# Altium project ESC.PrjPcb
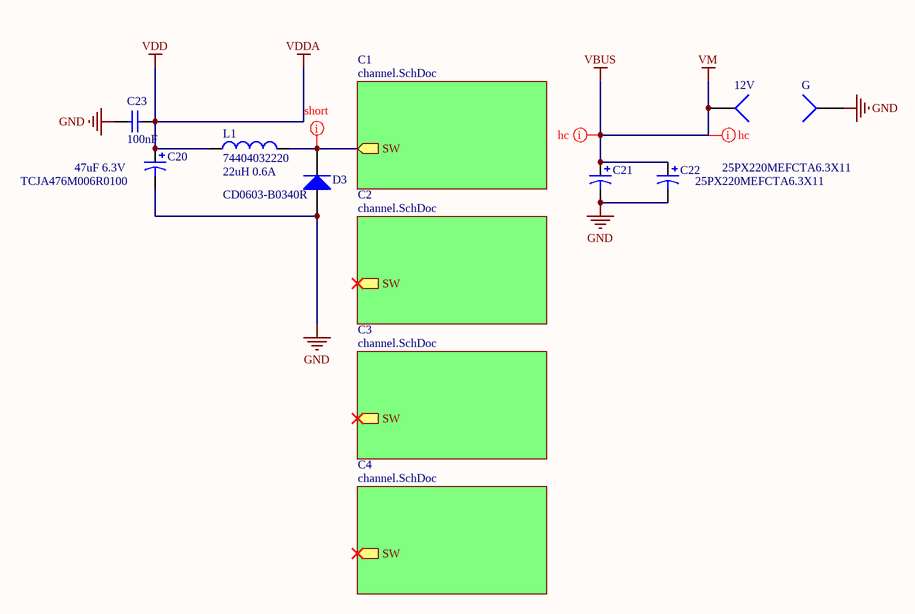
[diagram p0: esc.SchDoc]
3 sheets, 336 parts. Net scope: hierarchical (ports join the sheet entries above them; power ports are global).
Board file: esc.PcbDoc
Sheets:
  esc.SchDoc
    C1 = channel.SchDoc
      U = driver.SchDoc
      V = driver.SchDoc
      W = driver.SchDoc
    C2 = channel.SchDoc
      U = driver.SchDoc
      V = driver.SchDoc
      W = driver.SchDoc
    C3 = channel.SchDoc
      U = driver.SchDoc
      V = driver.SchDoc
      W = driver.SchDoc
    C4 = channel.SchDoc
      U = driver.SchDoc
      V = driver.SchDoc
      W = driver.SchDoc

## Sheet esc.SchDoc
size A4

### Parts
12V  12V  [large_pin]  (value not drawn)
C20  TCJA476M006R0100  value 47uF 6.3V  [my_1206_pol]
C21  25PX220MEFCTA6.3X11  [rad_2.5mm_0.7mm]
C22  25PX220MEFCTA6.3X11  [rad_2.5mm_0.7mm]
C23  100nF  [MY_0402]
D3  CD0603-B0340R  [my_0603]
G  G  [large_pin]  (value not drawn)
L1  74404032220  value 22uH 0.6A  [IND_3_3]

### Sub-sheets
C1 = channel.SchDoc: SW (out)
C2 = channel.SchDoc: SW (out)
C3 = channel.SchDoc: SW (out)
C4 = channel.SchDoc: SW (out)

### Nets
GND: C20.2 C21.2 C22.2 C23.1 D3.1(A) G.1
VBUS: 12V.1 C21.1 C22.1  [also labelled VM]
VDD: C20.1 C23.2 L1.1  [also labelled VDDA]
NetD3_2: D3.2(K) L1.2 ; sheet C1/SW

### Layout directives
net class hc: VBUS
net class short: NetD3_2

### Library data of the parts
12V G = Socket: LatestRevisionDate: 17-Jul-2002; LatestRevisionNote: Re-released for DXP Platform.; Publisher: Altium Limited
C20 = Cap Pol3: Polarized Capacitor (Surface Mount); Published: 8-Jun-2000; LatestRevisionDate: 29-May-2009; LatestRevisionNote: IPC-7351 Footprint Added.; PackageReference: C0805; Publisher: Altium Limited; PackageDescription: Chip Capacitor
C21 C22 = Cap Pol3: Polarized Capacitor (Surface Mount); Value: 10uF; Published: 8-Jun-2000; LatestRevisionDate: 29-May-2009; LatestRevisionNote: IPC-7351 Footprint Added.; PackageReference: C0805; Publisher: Altium Limited; PackageDescription: Chip Capacitor
C23 = Cap: Capacitor; Published: 8-Jun-2000; LatestRevisionDate: 17-Jul-2002; LatestRevisionNote: Re-released for DXP Platform.; PackageReference: RAD-0.3; Publisher: Altium Limited; PackageDescription: Radial Cap, Thru-Hole; 2 Leads; 0.3 in Pin Spacing; Value: 100nF
D3 = Diode: Default Diode; Published: 8-Jun-2000; LatestRevisionDate: 17-Jul-2002; LatestRevisionNote: Re-released for DXP Platform.; PackageVersion: Sep-1996; PackageReference: SMC; Publisher: Altium Limited; PackageDescription: DO-214-AB/SMC; 2 C-Bend Leads; Body 7.9 x 5.9 mm, inc. leads (LxW); Code_JEDEC: DO-214-AB
L1 = Inductor: Code_IEC: 1005; Published: 8-Jun-2000; LatestRevisionDate: 29-May-2009; LatestRevisionNote: IPC-7351 Footprint Added.; PackageReference: 0402-A; Publisher: Altium Limited; PackageDescription: Chip Inductor; Code_JEITA: 0402

## Sheet channel.SchDoc
size A4
Used 4 times, as channels C1, C2, C3, C4. Parts and nets are listed once, with the designators drawn on the sheet.
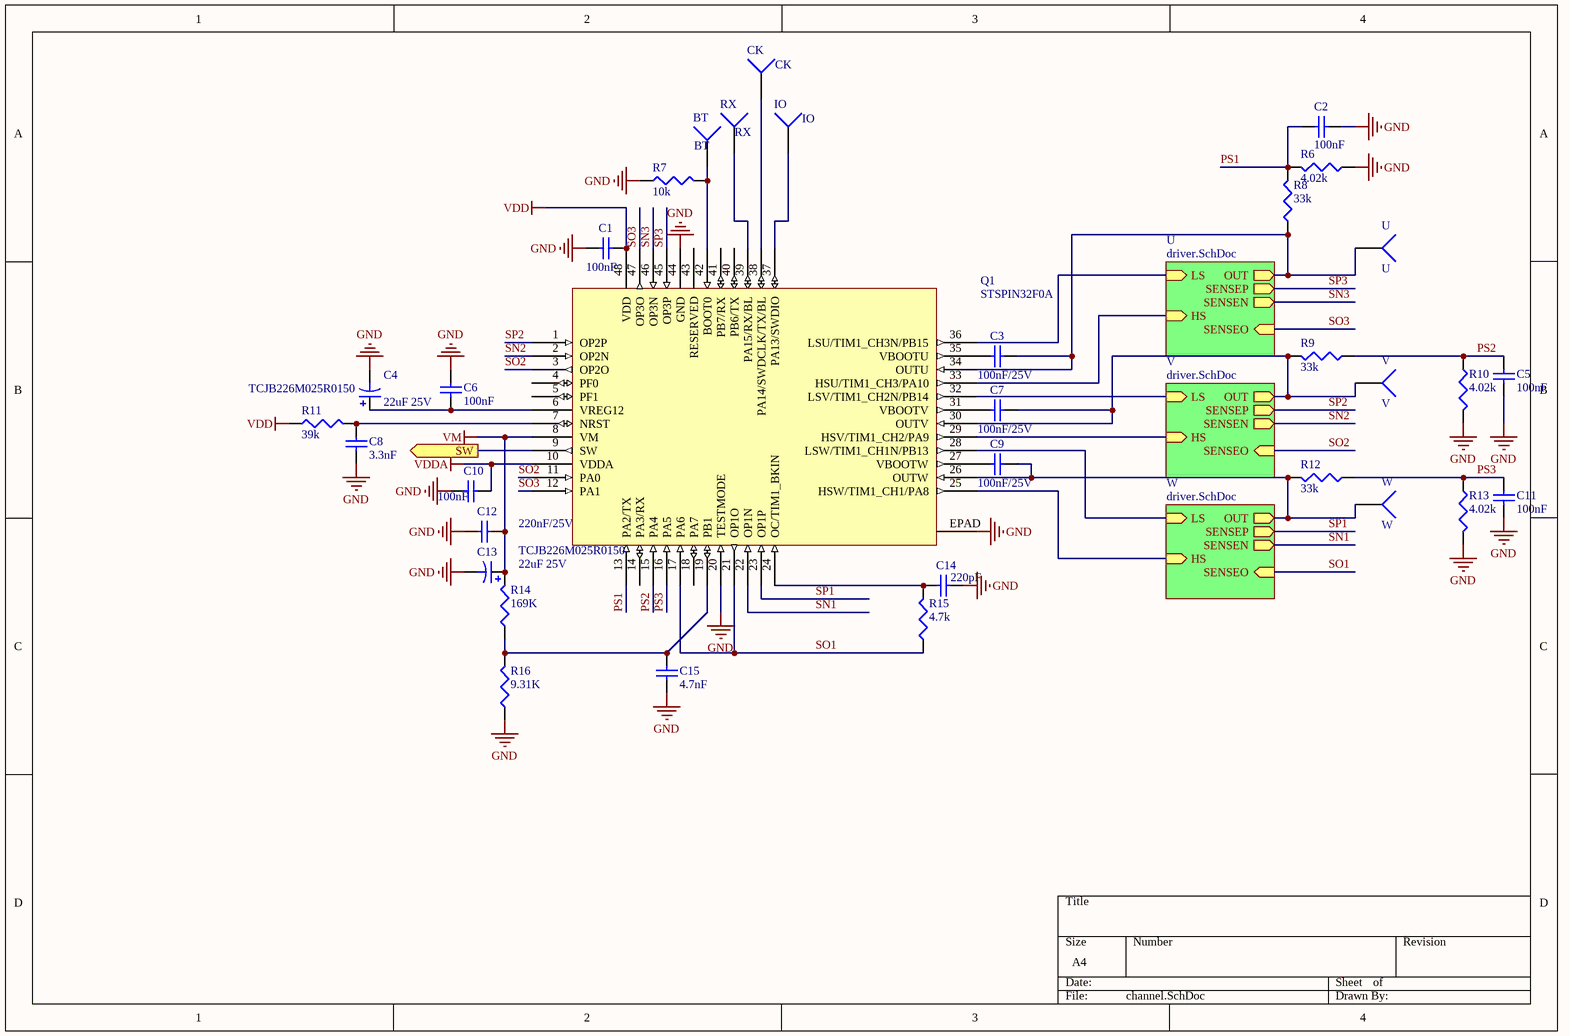
[diagram p1: channel.SchDoc]

### Parts
BT  BT  [solder_pin_small]
C1  100nF  [MY_0402]
C2  100nF  [MY_0402]
C3  100nF/25V  [MY_0402]
C4  TCJB226M025R0150  value 22uF 25V  [my_1210_pol]
C5  100nF  [MY_0402]
C6  100nF  [MY_0402]
C7  100nF/25V  [MY_0402]
C8  3.3nF  [MY_0402]
C9  100nF/25V  [MY_0402]
C10  100nF  [MY_0402]
C11  100nF  [MY_0402]
C12  220nF/25V  [MY_0402]
C13  TCJB226M025R0150  value 22uF 25V  [my_1210_pol]
C14  220pF  [MY_0402]
C15  4.7nF  [MY_0402]
CK  CK  [solder_pin_small]
IO  IO  [solder_pin_small]
Q1  STSPIN32F0A  [VFQFPN48]
R6  4.02k  [MY_0402]
R7  10k  [MY_0402]
R8  33k  [MY_0402]
R9  33k  [MY_0402]
R10  4.02k  [MY_0402]
R11  39k  [MY_0402]
R12  33k  [MY_0402]
R13  4.02k  [MY_0402]
R14  169K  [MY_0402]
R15  4.7k  [MY_0402]
R16  9.31K  [MY_0402]
RX  RX  [solder_pin_small]
U  U  [solder_pin_small]
V  V  [solder_pin_small]
W  W  [solder_pin_small]

### Sub-sheets
U = driver.SchDoc: LS (in), OUT (out), HS (in), SENSEP (out), SENSEN (out), SENSEO (in)
V = driver.SchDoc: LS (in), OUT (out), HS (in), SENSEP (out), SENSEN (out), SENSEO (in)
W = driver.SchDoc: LS (in), OUT (out), HS (in), SENSEP (out), SENSEN (out), SENSEO (in)

### Ports
SW (out)

### Nets
GND: C1.1 C2.2 C4.2 C5.1 C6.1 C8.2 C10.2 C11.1 C12.2 C13.2 C14.2 C15.2 Q1.20(TESTMODE) Q1.44(GND) Q1.EPAD R6.1 R7.1 R10.2 R13.2 R16.1
VDD: C1.2 Q1.48(VDD) R11.1
VDDA: C10.1 Q1.10(VDDA)
VM: C12.1 C13.1 Q1.8(VM) R14.2
PS1: C2.1 Q1.13(PA2/TX) R6.2 R8.2
PS2: C5.2 Q1.15(PA4) R9.1 R10.1
PS3: C11.2 Q1.16(PA5) R12.1 R13.1
SN1: Q1.22(OP1N) ; sheet W/SENSEN
SN2: Q1.2(OP2N) ; sheet V/SENSEN
SN3: Q1.46(OP3N) ; sheet U/SENSEN
SO1: Q1.17(PA6) Q1.21(OP1O) R15.1 ; sheet W/SENSEO
SO2: Q1.3(OP2O) Q1.11(PA0) ; sheet V/SENSEO
SO3: Q1.12(PA1) Q1.47(OP3O) ; sheet U/SENSEO
SP1: Q1.23(OP1P) ; sheet W/SENSEP
SP2: Q1.1(OP2P) ; sheet V/SENSEP
SP3: Q1.45(OP3P) ; sheet U/SENSEP
SW: Q1.9(SW) ; port SW
NetBT_1: BT.1 Q1.42(BOOT0) R7.2
NetC3_1: C3.1 Q1.35(VBOOTU)
NetC3_2: C3.2 Q1.34(OUTU) R8.1 U.1 ; sheet U/OUT
NetC4_1: C4.1 C6.2 Q1.6(VREG12)
NetC7_1: C7.1 Q1.31(VBOOTV)
NetC7_2: C7.2 Q1.30(OUTV) R9.2 V.1 ; sheet V/OUT
NetC8_1: C8.1 Q1.7(NRST) R11.2
NetC9_1: C9.1 Q1.27(VBOOTW)
NetC9_2: C9.2 Q1.26(OUTW) R12.2 W.1 ; sheet W/OUT
NetC14_1: C14.1 Q1.24(OC/TIM1_BKIN) R15.2
NetC15_1: C15.1 Q1.19(PB1) R14.1 R16.2
NetCK_1: CK.1 Q1.38(PA14/SWDCLK/TX/BL)
NetIO_1: IO.1 Q1.37(PA13/SWDIO)
NetQ1_25: Q1.25(HSW/TIM1_CH1/PA8) ; sheet W/HS
NetQ1_28: Q1.28(LSW/TIM1_CH1N/PB13) ; sheet W/LS
NetQ1_29: Q1.29(HSV/TIM1_CH2/PA9) ; sheet V/HS
NetQ1_32: Q1.32(LSV/TIM1_CH2N/PB14) ; sheet V/LS
NetQ1_33: Q1.33(HSU/TIM1_CH3/PA10) ; sheet U/HS
NetQ1_36: Q1.36(LSU/TIM1_CH3N/PB15) ; sheet U/LS
NetQ1_39: Q1.39(PA15/RX/BL) RX.1

Not connected (* = marked no-connect by the designer): Q1 4(PF0) 5(PF1) 14(PA3/RX) 18(PA7) 40(PB6/TX) 41(PB7/RX) 43(RESERVED)

### Channels
C1: designators end in _C1; ports SW=NetD3_2
C2: designators end in _C2; ports SW=NetQ1_C2_9
C3: designators end in _C3; ports SW=NetQ1_C3_9
C4: designators end in _C4; ports SW=NetQ1_C4_9

### Library data of the parts
BT CK IO RX U V W = Socket: LatestRevisionDate: 17-Jul-2002; LatestRevisionNote: Re-released for DXP Platform.; Publisher: Altium Limited
C1 C6 C10 C15 = Cap: Capacitor; Published: 8-Jun-2000; LatestRevisionDate: 17-Jul-2002; LatestRevisionNote: Re-released for DXP Platform.; PackageReference: RAD-0.3; Publisher: Altium Limited; PackageDescription: Radial Cap, Thru-Hole; 2 Leads; 0.3 in Pin Spacing
  C1 C6 C10: Value: 100nF
  C15: Value: 4.7nF
C2 C5 C11 C14 = Cap: Capacitor; Value: 4.7nF; Published: 8-Jun-2000; LatestRevisionDate: 17-Jul-2002; LatestRevisionNote: Re-released for DXP Platform.; PackageReference: RAD-0.3; Publisher: Altium Limited; PackageDescription: Radial Cap, Thru-Hole; 2 Leads; 0.3 in Pin Spacing
C3 C7-C9 C12 = Cap: Capacitor; Value: 100nF; Published: 8-Jun-2000; LatestRevisionDate: 17-Jul-2002; LatestRevisionNote: Re-released for DXP Platform.; PackageReference: RAD-0.3; Publisher: Altium Limited; PackageDescription: Radial Cap, Thru-Hole; 2 Leads; 0.3 in Pin Spacing
C4 C13 = Cap Pol3: Polarized Capacitor (Surface Mount); Published: 8-Jun-2000; LatestRevisionDate: 29-May-2009; LatestRevisionNote: IPC-7351 Footprint Added.; PackageReference: C0805; Publisher: Altium Limited; PackageDescription: Chip Capacitor
R6 R8-R16 = Res3: Resistor; Value: 10K; Published: 8-Jun-2000; LatestRevisionDate: 29-May-2009; LatestRevisionNote: IPC-7351 Footprint Added.; PackageReference: J1-0603; Publisher: Altium Limited; PackageDescription: Chip Resistor
R7 = Res3: Resistor; Published: 8-Jun-2000; LatestRevisionDate: 29-May-2009; LatestRevisionNote: IPC-7351 Footprint Added.; PackageReference: J1-0603; Publisher: Altium Limited; PackageDescription: Chip Resistor; Value: 10K

## Sheet driver.SchDoc
size A4
Used 12 times, as channels C1/U, C1/V, C1/W, C2/U, C2/V, C2/W, C3/U, C3/V, C3/W, C4/U, C4/V, C4/W. Parts and nets are listed once, with the designators drawn on the sheet.
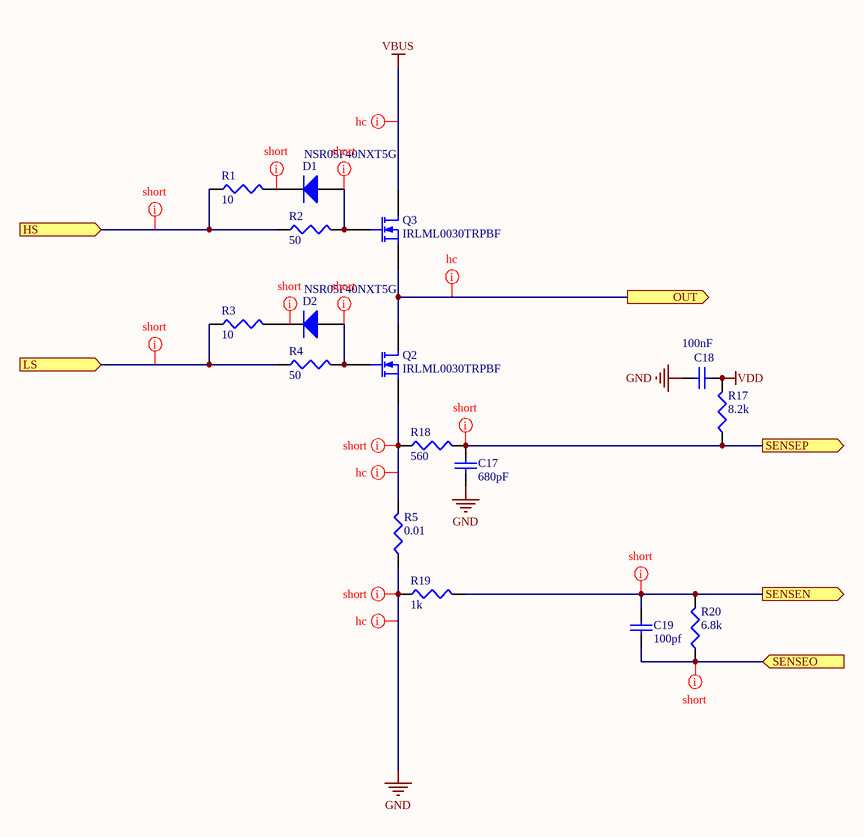
[diagram p2: driver.SchDoc]

### Parts
C17  680pF  [MY_0402]
C18  100nF  [MY_0402]
C19  100pf  [MY_0402]
D1  NSR05F40NXT5G  [MY_0402]
D2  NSR05F40NXT5G  [MY_0402]
Q2  IRLML0030TRPBF  [Micro3]
Q3  IRLML0030TRPBF  [Micro3]
R1  10  [MY_0402]
R2  50  [MY_0402]
R3  10  [MY_0402]
R4  50  [MY_0402]
R5  0.01  [MY_0603]
R17  8.2k  [MY_0402]
R18  560  [MY_0402]
R19  1k  [MY_0402]
R20  6.8k  [MY_0402]

### Ports
HS (in), LS (in), OUT (out), SENSEN (out), SENSEO (in), SENSEP (out)

### Nets
GND: C17.2 C18.1 R5.1 R19.1
VBUS: Q3.D
VDD: C18.2 R17.2
HS: R1.1 R2.1 ; port HS
LS: R3.1 R4.1 ; port LS
OUT: Q2.D Q3.S ; port OUT
SENSEN: C19.1 R19.2 R20.2 ; port SENSEN
SENSEO: C19.2 R20.1 ; port SENSEO
SENSEP: C17.1 R17.1 R18.2 ; port SENSEP
NetD1_1: D1.1(A) Q3.G R2.2
NetD1_2: D1.2(K) R1.2
NetD2_1: D2.1(A) Q2.G R4.2
NetD2_2: D2.2(K) R3.2
NetQ2_S: Q2.S R5.2 R18.1

### Channels
C1/U: designators end in _U1; ports HS=NetQ1_C1_33 LS=NetQ1_C1_36 OUT=NetC3_C1_2 SENSEN=SN3_C1 SENSEO=SO3_C1 SENSEP=SP3_C1
C1/V: designators end in _V1; ports HS=NetQ1_C1_29 LS=NetQ1_C1_32 OUT=NetC7_C1_2 SENSEN=SN2_C1 SENSEO=SO2_C1 SENSEP=SP2_C1
C1/W: designators end in _W1; ports HS=NetQ1_C1_25 LS=NetQ1_C1_28 OUT=NetC9_C1_2 SENSEN=SN1_C1 SENSEO=SO1_C1 SENSEP=SP1_C1
C2/U: designators end in _U2; ports HS=NetQ1_C2_33 LS=NetQ1_C2_36 OUT=NetC3_C2_2 SENSEN=SN3_C2 SENSEO=SO3_C2 SENSEP=SP3_C2
C2/V: designators end in _V2; ports HS=NetQ1_C2_29 LS=NetQ1_C2_32 OUT=NetC7_C2_2 SENSEN=SN2_C2 SENSEO=SO2_C2 SENSEP=SP2_C2
C2/W: designators end in _W2; ports HS=NetQ1_C2_25 LS=NetQ1_C2_28 OUT=NetC9_C2_2 SENSEN=SN1_C2 SENSEO=SO1_C2 SENSEP=SP1_C2
C3/U: designators end in _U3; ports HS=NetQ1_C3_33 LS=NetQ1_C3_36 OUT=NetC3_C3_2 SENSEN=SN3_C3 SENSEO=SO3_C3 SENSEP=SP3_C3
C3/V: designators end in _V3; ports HS=NetQ1_C3_29 LS=NetQ1_C3_32 OUT=NetC7_C3_2 SENSEN=SN2_C3 SENSEO=SO2_C3 SENSEP=SP2_C3
C3/W: designators end in _W3; ports HS=NetQ1_C3_25 LS=NetQ1_C3_28 OUT=NetC9_C3_2 SENSEN=SN1_C3 SENSEO=SO1_C3 SENSEP=SP1_C3
C4/U: designators end in _U4; ports HS=NetQ1_C4_33 LS=NetQ1_C4_36 OUT=NetC3_C4_2 SENSEN=SN3_C4 SENSEO=SO3_C4 SENSEP=SP3_C4
C4/V: designators end in _V4; ports HS=NetQ1_C4_29 LS=NetQ1_C4_32 OUT=NetC7_C4_2 SENSEN=SN2_C4 SENSEO=SO2_C4 SENSEP=SP2_C4
C4/W: designators end in _W4; ports HS=NetQ1_C4_25 LS=NetQ1_C4_28 OUT=NetC9_C4_2 SENSEN=SN1_C4 SENSEO=SO1_C4 SENSEP=SP1_C4

### Layout directives
net class short: (no net found under the mark), GND, NetD1_U1_1, NetD1_U1_2, NetD2_U1_1, NetQ1_C1_33, NetQ1_C1_36, NetQ2_U1_S, SN3_C1, SO3_C1, SP3_C1
net class hc: GND, NetC3_C1_2, NetQ2_U1_S, VBUS

### Library data of the parts
C17-C19 = Cap: Capacitor; Value: 10nF; Published: 8-Jun-2000; LatestRevisionDate: 17-Jul-2002; LatestRevisionNote: Re-released for DXP Platform.; PackageReference: RAD-0.3; Publisher: Altium Limited; PackageDescription: Radial Cap, Thru-Hole; 2 Leads; 0.3 in Pin Spacing
D1 D2 = Diode: Default Diode; Published: 8-Jun-2000; LatestRevisionDate: 17-Jul-2002; LatestRevisionNote: Re-released for DXP Platform.; PackageVersion: Sep-1996; PackageReference: SMC; Publisher: Altium Limited; PackageDescription: DO-214-AB/SMC; 2 C-Bend Leads; Body 7.9 x 5.9 mm, inc. leads (LxW); Code_JEDEC: DO-214-AB
Q2 Q3 = MOSFET-N: N-Channel MOSFET; Published: 8-Jun-2000; LatestRevisionDate: 17-Jul-2002; LatestRevisionNote: Re-released for DXP Platform.; PackageVersion: 1995/1996; PackageReference: E3; Publisher: Altium Limited; PackageDescription: TO, Flat Index; 3 In-Line, Axial Leads; Body Dia. 4.6mm; Lead Dia. 0.5 mm (max)
R1-R4 R19 = Res3: Resistor; Published: 8-Jun-2000; LatestRevisionDate: 29-May-2009; LatestRevisionNote: IPC-7351 Footprint Added.; PackageReference: J1-0603; Publisher: Altium Limited; PackageDescription: Chip Resistor
  R1 R3: Value: 10
  R2 R4: Value: 50
  R19: Value: 1K
R5 R17 R18 R20 = Res3: Resistor; Value: 1K; Published: 8-Jun-2000; LatestRevisionDate: 29-May-2009; LatestRevisionNote: IPC-7351 Footprint Added.; PackageReference: J1-0603; Publisher: Altium Limited; PackageDescription: Chip Resistor

## Nets that join several sheets
GND: esc (6 pins), C1 (20 pins), C1/U (C17_U1.2 C18_U1.1 R5_U1.1 R19_U1.1), C1/V (C17_V1.2 C18_V1.1 R5_V1.1 R19_V1.1), C1/W (C17_W1.2 C18_W1.1 R5_W1.1 R19_W1.1), C2 (20 pins), C2/U (C17_U2.2 C18_U2.1 R5_U2.1 R19_U2.1), C2/V (C17_V2.2 C18_V2.1 R5_V2.1 R19_V2.1), C2/W (C17_W2.2 C18_W2.1 R5_W2.1 R19_W2.1), C3 (20 pins), C3/U (C17_U3.2 C18_U3.1 R5_U3.1 R19_U3.1), C3/V (C17_V3.2 C18_V3.1 R5_V3.1 R19_V3.1), C3/W (C17_W3.2 C18_W3.1 R5_W3.1 R19_W3.1), C4 (20 pins), C4/U (C17_U4.2 C18_U4.1 R5_U4.1 R19_U4.1), C4/V (C17_V4.2 C18_V4.1 R5_V4.1 R19_V4.1), C4/W (C17_W4.2 C18_W4.1 R5_W4.1 R19_W4.1)
VBUS: esc (12V.1 C21.1 C22.1), C1 (C12_C1.1 C13_C1.1 Q1_C1.8 R14_C1.2), C1/U (Q3_U1.D), C1/V (Q3_V1.D), C1/W (Q3_W1.D), C2 (C12_C2.1 C13_C2.1 Q1_C2.8 R14_C2.2), C2/U (Q3_U2.D), C2/V (Q3_V2.D), C2/W (Q3_W2.D), C3 (C12_C3.1 C13_C3.1 Q1_C3.8 R14_C3.2), C3/U (Q3_U3.D), C3/V (Q3_V3.D), C3/W (Q3_W3.D), C4 (C12_C4.1 C13_C4.1 Q1_C4.8 R14_C4.2), C4/U (Q3_U4.D), C4/V (Q3_V4.D), C4/W (Q3_W4.D)
VDD: esc (C20.1 C23.2 L1.1), C1 (5 pins), C1/U (C18_U1.2 R17_U1.2), C1/V (C18_V1.2 R17_V1.2), C1/W (C18_W1.2 R17_W1.2), C2 (5 pins), C2/U (C18_U2.2 R17_U2.2), C2/V (C18_V2.2 R17_V2.2), C2/W (C18_W2.2 R17_W2.2), C3 (5 pins), C3/U (C18_U3.2 R17_U3.2), C3/V (C18_V3.2 R17_V3.2), C3/W (C18_W3.2 R17_W3.2), C4 (5 pins), C4/U (C18_U4.2 R17_U4.2), C4/V (C18_V4.2 R17_V4.2), C4/W (C18_W4.2 R17_W4.2)
NetC3_C1_2: C1 (C3_C1.2 Q1_C1.34 R8_C1.1 U_C1.1), C1/U (Q2_U1.D Q3_U1.S)
NetC3_C2_2: C2 (C3_C2.2 Q1_C2.34 R8_C2.1 U_C2.1), C2/U (Q2_U2.D Q3_U2.S)
NetC3_C3_2: C3 (C3_C3.2 Q1_C3.34 R8_C3.1 U_C3.1), C3/U (Q2_U3.D Q3_U3.S)
NetC3_C4_2: C4 (C3_C4.2 Q1_C4.34 R8_C4.1 U_C4.1), C4/U (Q2_U4.D Q3_U4.S)
NetC7_C1_2: C1 (C7_C1.2 Q1_C1.30 R9_C1.2 V_C1.1), C1/V (Q2_V1.D Q3_V1.S)
NetC7_C2_2: C2 (C7_C2.2 Q1_C2.30 R9_C2.2 V_C2.1), C2/V (Q2_V2.D Q3_V2.S)
NetC7_C3_2: C3 (C7_C3.2 Q1_C3.30 R9_C3.2 V_C3.1), C3/V (Q2_V3.D Q3_V3.S)
NetC7_C4_2: C4 (C7_C4.2 Q1_C4.30 R9_C4.2 V_C4.1), C4/V (Q2_V4.D Q3_V4.S)
NetC9_C1_2: C1 (C9_C1.2 Q1_C1.26 R12_C1.2 W_C1.1), C1/W (Q2_W1.D Q3_W1.S)
NetC9_C2_2: C2 (C9_C2.2 Q1_C2.26 R12_C2.2 W_C2.1), C2/W (Q2_W2.D Q3_W2.S)
NetC9_C3_2: C3 (C9_C3.2 Q1_C3.26 R12_C3.2 W_C3.1), C3/W (Q2_W3.D Q3_W3.S)
NetC9_C4_2: C4 (C9_C4.2 Q1_C4.26 R12_C4.2 W_C4.1), C4/W (Q2_W4.D Q3_W4.S)
NetD3_2: esc (D3.2 L1.2), C1 (Q1_C1.9)
NetQ1_C1_25: C1 (Q1_C1.25), C1/W (R1_W1.1 R2_W1.1)
NetQ1_C1_28: C1 (Q1_C1.28), C1/W (R3_W1.1 R4_W1.1)
NetQ1_C1_29: C1 (Q1_C1.29), C1/V (R1_V1.1 R2_V1.1)
NetQ1_C1_32: C1 (Q1_C1.32), C1/V (R3_V1.1 R4_V1.1)
NetQ1_C1_33: C1 (Q1_C1.33), C1/U (R1_U1.1 R2_U1.1)
NetQ1_C1_36: C1 (Q1_C1.36), C1/U (R3_U1.1 R4_U1.1)
NetQ1_C2_25: C2 (Q1_C2.25), C2/W (R1_W2.1 R2_W2.1)
NetQ1_C2_28: C2 (Q1_C2.28), C2/W (R3_W2.1 R4_W2.1)
NetQ1_C2_29: C2 (Q1_C2.29), C2/V (R1_V2.1 R2_V2.1)
NetQ1_C2_32: C2 (Q1_C2.32), C2/V (R3_V2.1 R4_V2.1)
NetQ1_C2_33: C2 (Q1_C2.33), C2/U (R1_U2.1 R2_U2.1)
NetQ1_C2_36: C2 (Q1_C2.36), C2/U (R3_U2.1 R4_U2.1)
NetQ1_C3_25: C3 (Q1_C3.25), C3/W (R1_W3.1 R2_W3.1)
NetQ1_C3_28: C3 (Q1_C3.28), C3/W (R3_W3.1 R4_W3.1)
NetQ1_C3_29: C3 (Q1_C3.29), C3/V (R1_V3.1 R2_V3.1)
NetQ1_C3_32: C3 (Q1_C3.32), C3/V (R3_V3.1 R4_V3.1)
NetQ1_C3_33: C3 (Q1_C3.33), C3/U (R1_U3.1 R2_U3.1)
NetQ1_C3_36: C3 (Q1_C3.36), C3/U (R3_U3.1 R4_U3.1)
NetQ1_C4_25: C4 (Q1_C4.25), C4/W (R1_W4.1 R2_W4.1)
NetQ1_C4_28: C4 (Q1_C4.28), C4/W (R3_W4.1 R4_W4.1)
NetQ1_C4_29: C4 (Q1_C4.29), C4/V (R1_V4.1 R2_V4.1)
NetQ1_C4_32: C4 (Q1_C4.32), C4/V (R3_V4.1 R4_V4.1)
NetQ1_C4_33: C4 (Q1_C4.33), C4/U (R1_U4.1 R2_U4.1)
NetQ1_C4_36: C4 (Q1_C4.36), C4/U (R3_U4.1 R4_U4.1)
SN1_C1: C1 (Q1_C1.22), C1/W (C19_W1.1 R19_W1.2 R20_W1.2)
SN1_C2: C2 (Q1_C2.22), C2/W (C19_W2.1 R19_W2.2 R20_W2.2)
SN1_C3: C3 (Q1_C3.22), C3/W (C19_W3.1 R19_W3.2 R20_W3.2)
SN1_C4: C4 (Q1_C4.22), C4/W (C19_W4.1 R19_W4.2 R20_W4.2)
SN2_C1: C1 (Q1_C1.2), C1/V (C19_V1.1 R19_V1.2 R20_V1.2)
SN2_C2: C2 (Q1_C2.2), C2/V (C19_V2.1 R19_V2.2 R20_V2.2)
SN2_C3: C3 (Q1_C3.2), C3/V (C19_V3.1 R19_V3.2 R20_V3.2)
SN2_C4: C4 (Q1_C4.2), C4/V (C19_V4.1 R19_V4.2 R20_V4.2)
SN3_C1: C1 (Q1_C1.46), C1/U (C19_U1.1 R19_U1.2 R20_U1.2)
SN3_C2: C2 (Q1_C2.46), C2/U (C19_U2.1 R19_U2.2 R20_U2.2)
SN3_C3: C3 (Q1_C3.46), C3/U (C19_U3.1 R19_U3.2 R20_U3.2)
SN3_C4: C4 (Q1_C4.46), C4/U (C19_U4.1 R19_U4.2 R20_U4.2)
SO1_C1: C1 (Q1_C1.17 Q1_C1.21 R15_C1.1), C1/W (C19_W1.2 R20_W1.1)
SO1_C2: C2 (Q1_C2.17 Q1_C2.21 R15_C2.1), C2/W (C19_W2.2 R20_W2.1)
SO1_C3: C3 (Q1_C3.17 Q1_C3.21 R15_C3.1), C3/W (C19_W3.2 R20_W3.1)
SO1_C4: C4 (Q1_C4.17 Q1_C4.21 R15_C4.1), C4/W (C19_W4.2 R20_W4.1)
SO2_C1: C1 (Q1_C1.3 Q1_C1.11), C1/V (C19_V1.2 R20_V1.1)
SO2_C2: C2 (Q1_C2.3 Q1_C2.11), C2/V (C19_V2.2 R20_V2.1)
SO2_C3: C3 (Q1_C3.3 Q1_C3.11), C3/V (C19_V3.2 R20_V3.1)
SO2_C4: C4 (Q1_C4.3 Q1_C4.11), C4/V (C19_V4.2 R20_V4.1)
SO3_C1: C1 (Q1_C1.12 Q1_C1.47), C1/U (C19_U1.2 R20_U1.1)
SO3_C2: C2 (Q1_C2.12 Q1_C2.47), C2/U (C19_U2.2 R20_U2.1)
SO3_C3: C3 (Q1_C3.12 Q1_C3.47), C3/U (C19_U3.2 R20_U3.1)
SO3_C4: C4 (Q1_C4.12 Q1_C4.47), C4/U (C19_U4.2 R20_U4.1)
SP1_C1: C1 (Q1_C1.23), C1/W (C17_W1.1 R17_W1.1 R18_W1.2)
SP1_C2: C2 (Q1_C2.23), C2/W (C17_W2.1 R17_W2.1 R18_W2.2)
SP1_C3: C3 (Q1_C3.23), C3/W (C17_W3.1 R17_W3.1 R18_W3.2)
SP1_C4: C4 (Q1_C4.23), C4/W (C17_W4.1 R17_W4.1 R18_W4.2)
SP2_C1: C1 (Q1_C1.1), C1/V (C17_V1.1 R17_V1.1 R18_V1.2)
SP2_C2: C2 (Q1_C2.1), C2/V (C17_V2.1 R17_V2.1 R18_V2.2)
SP2_C3: C3 (Q1_C3.1), C3/V (C17_V3.1 R17_V3.1 R18_V3.2)
SP2_C4: C4 (Q1_C4.1), C4/V (C17_V4.1 R17_V4.1 R18_V4.2)
SP3_C1: C1 (Q1_C1.45), C1/U (C17_U1.1 R17_U1.1 R18_U1.2)
SP3_C2: C2 (Q1_C2.45), C2/U (C17_U2.1 R17_U2.1 R18_U2.2)
SP3_C3: C3 (Q1_C3.45), C3/U (C17_U3.1 R17_U3.1 R18_U3.2)
SP3_C4: C4 (Q1_C4.45), C4/U (C17_U4.1 R17_U4.1 R18_U4.2)